# EAGLE schematic Quasar_v0.1 (EAGLE 8.7.1)
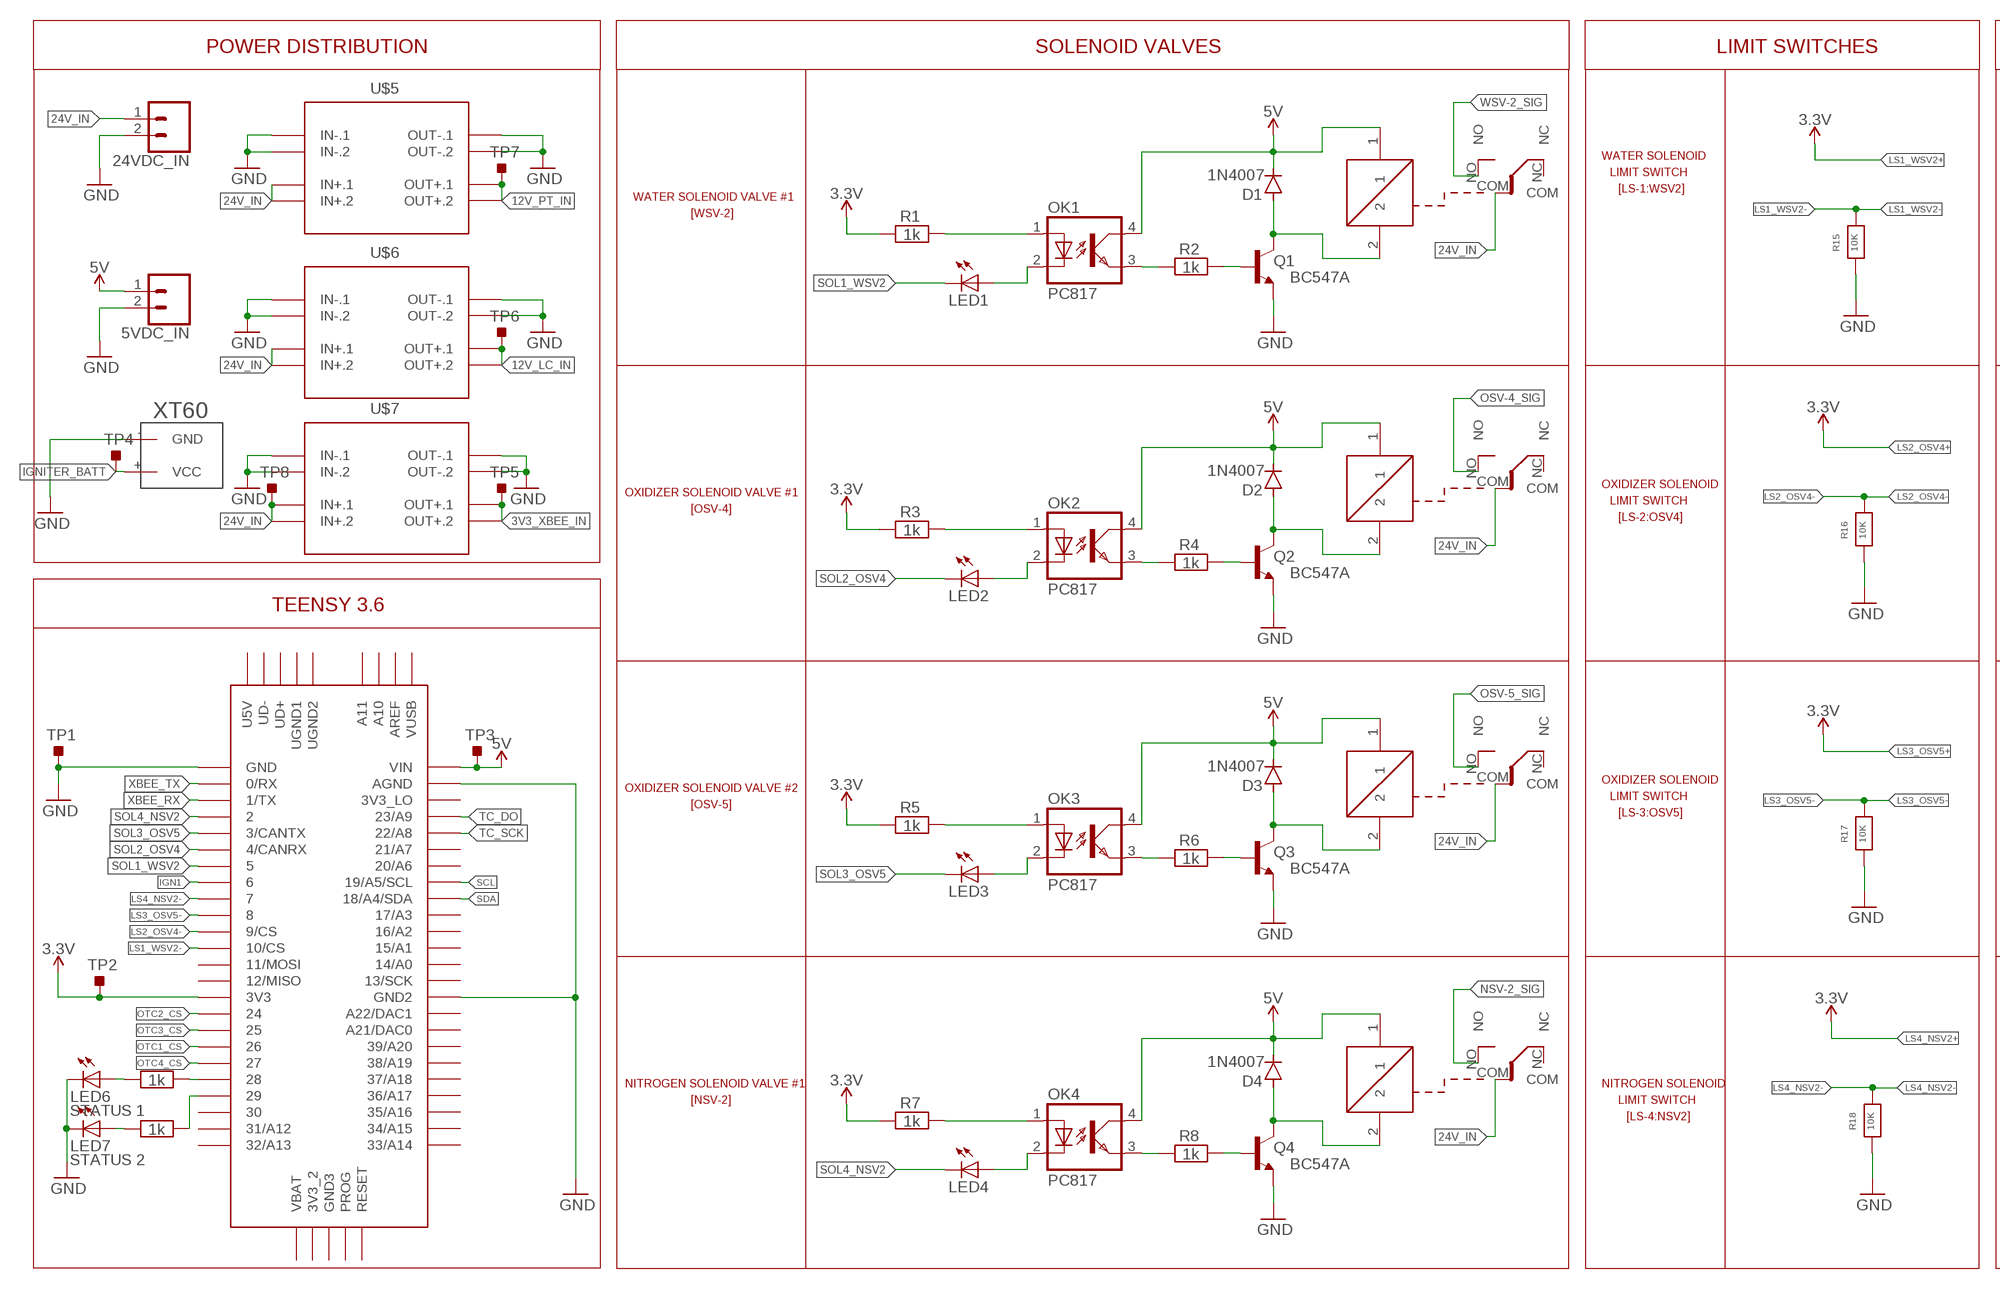
[diagram p0: schematic, sheet 1, part 1 of 2]
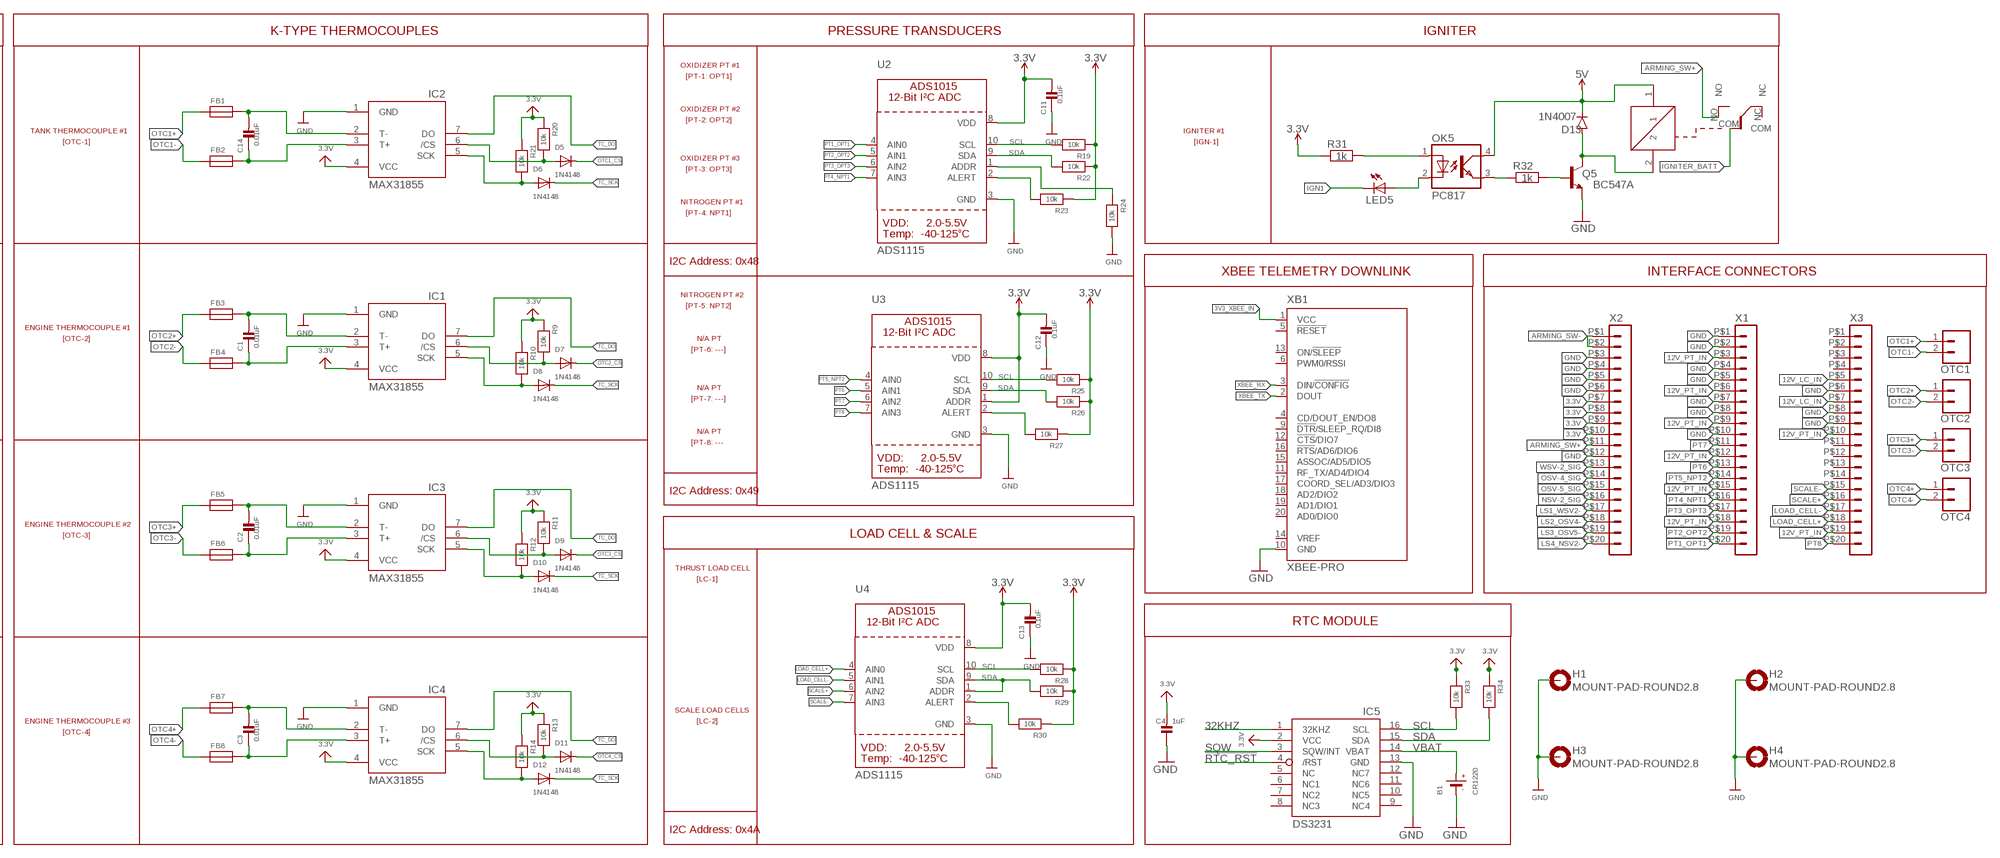
[diagram p1: schematic, sheet 1, part 2 of 2]

## Parts
5VDC_IN  CONN_025MM  [SCREWTERMINAL-5MM-2]
24VDC_IN  CONN_025MM  [SCREWTERMINAL-5MM-2]
B1  CR1220  BATTERYCR1220_SMT  [CR1220]
C1  0.01uF  CAP_CERAMIC0805  [0805]
C2  0.01uF  CAP_CERAMIC0805  [0805]
C3  0.01uF  CAP_CERAMIC0805  [0805]
C4  1uF  CAP_CERAMIC0805  [0805]
C11  0.1uF  CAP_CERAMIC0805  [0805]
C12  0.1uF  CAP_CERAMIC0805  [0805]
C13  0.1uF  CAP_CERAMIC0805  [0805]
C14  0.01uF  CAP_CERAMIC0805  [0805]
D1  1N4007  [DO-41]
D2  1N4007  [DO-41]
D3  1N4007  [DO-41]
D4  1N4007  [DO-41]
D5  1N4148  DIODESOD-123  [SOD-123]
D6  1N4148  DIODESOD-123  [SOD-123]
D7  1N4148  DIODESOD-123  [SOD-123]
D8  1N4148  DIODESOD-123  [SOD-123]
D9  1N4148  DIODESOD-123  [SOD-123]
D10  1N4148  DIODESOD-123  [SOD-123]
D11  1N4148  DIODESOD-123  [SOD-123]
D12  1N4148  DIODESOD-123  [SOD-123]
D13  1N4007  [DO-41]
FB1  FERRITE  [0603]
FB2  FERRITE  [0603]
FB3  FERRITE  [0603]
FB4  FERRITE  [0603]
FB5  FERRITE  [0603]
FB6  FERRITE  [0603]
FB7  FERRITE  [0603]
FB8  FERRITE  [0603]
H1  MOUNT-PAD-ROUND2.8  [2,8-PAD]
H2  MOUNT-PAD-ROUND2.8  [2,8-PAD]
H3  MOUNT-PAD-ROUND2.8  [2,8-PAD]
H4  MOUNT-PAD-ROUND2.8  [2,8-PAD]
IC1  MAX31855  MAX6675  [SO08]
IC2  MAX31855  MAX6675  [SO08]
IC3  MAX31855  MAX6675  [SO08]
IC4  MAX31855  MAX6675  [SO08]
IC5  DS3231/SO  [SO16W]
LED1  LEDCHIPLED_1206  [CHIPLED_1206]
LED2  LEDCHIPLED_1206  [CHIPLED_1206]
LED3  LEDCHIPLED_1206  [CHIPLED_1206]
LED4  LEDCHIPLED_1206  [CHIPLED_1206]
LED5  LEDCHIPLED_1206  [CHIPLED_1206]
LED6  STATUS 1  LED5MM  [LED5MM]
LED7  STATUS 2  LED5MM  [LED5MM]
OK1  PC817  [DIL04]
OK2  PC817  [DIL04]
OK3  PC817  [DIL04]
OK4  PC817  [DIL04]
OK5  PC817  [DIL04]
OTC1  CONN_025MM  [SCREWTERMINAL-5MM-2]
OTC2  CONN_025MM  [SCREWTERMINAL-5MM-2]
OTC3  CONN_025MM  [SCREWTERMINAL-5MM-2]
OTC4  CONN_025MM  [SCREWTERMINAL-5MM-2]
Q1  BC547A  [TO92]
Q2  BC547A  [TO92]
Q3  BC547A  [TO92]
Q4  BC547A  [TO92]
Q5  BC547A  [TO92]
R1  1k  RESISTOR0805  [0805]
R2  1k  RESISTOR0805  [0805]
R3  1k  RESISTOR0805  [0805]
R4  1k  RESISTOR0805  [0805]
R5  1k  RESISTOR0805  [0805]
R6  1k  RESISTOR0805  [0805]
R7  1k  RESISTOR0805  [0805]
R8  1k  RESISTOR0805  [0805]
R9  10k  RESISTOR0805  [0805]
R10  10k  RESISTOR0805  [0805]
R11  10k  RESISTOR0805  [0805]
R12  10k  RESISTOR0805  [0805]
R13  10k  RESISTOR0805  [0805]
R14  10k  RESISTOR0805  [0805]
R15  10K  RESISTOR0805  [0805]
R16  10K  RESISTOR0805  [0805]
R17  10K  RESISTOR0805  [0805]
R18  10K  RESISTOR0805  [0805]
R19  10k  RESISTOR0805  [0805]
R20  10k  RESISTOR0805  [0805]
R21  10k  RESISTOR0805  [0805]
R22  10k  RESISTOR0805  [0805]
R23  10k  RESISTOR0805  [0805]
R24  10k  RESISTOR0805  [0805]
R25  10k  RESISTOR0805  [0805]
R26  10k  RESISTOR0805  [0805]
R27  10k  RESISTOR0805  [0805]
R28  10k  RESISTOR0805  [0805]
R29  10k  RESISTOR0805  [0805]
R30  10k  RESISTOR0805  [0805]
R31  1k  RESISTOR0805  [0805]
R32  1k  RESISTOR0805  [0805]
R33  10k  RESISTOR0805  [0805]
R34  10k  RESISTOR0805  [0805]
R35  1k  RESISTOR0805  [0805]
R36  1k  RESISTOR0805  [0805]
TP1  TESTPOINT_TPS-SMD-10SN  [TESTPOINT_SMD-10SN]
TP2  TESTPOINT_TPS-SMD-10SN  [TESTPOINT_SMD-10SN]
TP3  TESTPOINT_TPS-SMD-10SN  [TESTPOINT_SMD-10SN]
TP4  TESTPOINT_TPS-SMD-10SN  [TESTPOINT_SMD-10SN]
TP5  TESTPOINT_TPS-SMD-10SN  [TESTPOINT_SMD-10SN]
TP6  TESTPOINT_TPS-SMD-10SN  [TESTPOINT_SMD-10SN]
TP7  TESTPOINT_TPS-SMD-10SN  [TESTPOINT_SMD-10SN]
TP8  TESTPOINT_TPS-SMD-10SN  [TESTPOINT_SMD-10SN]
U2  ADS1115  ADC_ADS1015  [MSOP10]
U3  ADS1115  ADC_ADS1015  [MSOP10]
U4  ADS1115  ADC_ADS1015  [MSOP10]
U$1  TEENSY_3.5/3.6  [TEENSY_3.5/3.6]
U$2  RW-SH  [RW-SH]
U$3  RW-SH  [RW-SH]
U$4  RW-SH  [RW-SH]
U$5  12V_PT_REG  DC-DC-STEP-DOWN-MP1584  [DC-DC-STEP-DOWN-MP1584]
U$6  12V_LC_REG  DC-DC-STEP-DOWN-MP1584  [DC-DC-STEP-DOWN-MP1584]
U$7  3V3_XBEE_REG  DC-DC-STEP-DOWN-MP1584  [DC-DC-STEP-DOWN-MP1584]
U$13  RW-SH  [RW-SH]
U$18  RW-SH  [RW-SH]
U$19  XT60  [XT60]
X1  HEADER_POS20_44914-2001  [44914-2001]
X2  HEADER_POS20_44914-2001  [44914-2001]
X3  HEADER_POS20_44914-2001  [44914-2001]
XB1  XBEE-PRO  [XBEE-PRO]

## Nets
3.3V: C4.2 C11.2 C12.2 C13.2 IC1.4(VCC) IC2.4(VCC) IC3.4(VCC) IC4.4(VCC) IC5.2(VCC) R1.2 R3.2 R5.2 R7.2 R9.1 R10.1 R11.1 R12.1 R13.1 R14.1 R19.1 R20.1 R21.1 R22.1 R23.1 R25.1 R26.1 R27.1 R28.1 R29.1 R30.1 R31.2 R33.1 R34.1 TP2.TP U2.8(VDD) U3.1(ADDR) U3.8(VDD) U4.8(VDD) U$1.3V3 X2.P$7 X2.P$8 X2.P$9 X2.P$10
3V3_XBEE_IN: TP5.TP U$7.OUT+.1 U$7.OUT+.2 XB1.1(VCC)
5V: 5VDC_IN.1 D1.C D2.C D3.C D4.C D13.C OK1.4(COL) OK2.4(COL) OK3.4(COL) OK4.4(COL) OK5.4(COL) TP3.TP U$1.VIN U$2.1 U$3.1 U$4.1 U$13.1 U$18.1
12V_LC_IN: TP6.TP U$6.OUT+.1 U$6.OUT+.2 X3.P$5 X3.P$7
12V_PT_IN: TP7.TP U$5.OUT+.1 U$5.OUT+.2 X1.P$3 X1.P$6 X1.P$9 X1.P$12 X1.P$15 X1.P$18 X3.P$10 X3.P$19
24V_IN: 24VDC_IN.1 TP8.TP U$2.COM U$3.COM U$4.COM U$5.IN+.1 U$5.IN+.2 U$6.IN+.1 U$6.IN+.2 U$7.IN+.1 U$7.IN+.2 U$13.COM
32KHZ: IC5.1(32KHZ)
!RTC_RST: IC5.4(/RST)
ARMING_SW+: U$18.NO X2.P$11
ARMING_SW-: X2.P$1 X2.P$2
GND: 5VDC_IN.2 24VDC_IN.2 B1.- C4.1 C11.1 C12.1 C13.1 H1.B2,8(MOUNT) H2.B2,8(MOUNT) H3.B2,8(MOUNT) H4.B2,8(MOUNT) IC1.1(GND) IC2.1(GND) IC3.1(GND) IC4.1(GND) IC5.13(GND) LED6.K(C) LED7.K(C) Q1.1(E) Q2.1(E) Q3.1(E) Q4.1(E) Q5.1(E) R15.2 R16.2 R17.2 R18.2 R24.2 TP1.TP U2.3(GND) U3.3(GND) U4.3(GND) U$1.AGND U$1.GND U$1.GND2 U$5.IN-.1 U$5.IN-.2 U$5.OUT-.1 U$5.OUT-.2 U$6.IN-.1 U$6.IN-.2 U$6.OUT-.1 U$6.OUT-.2 U$7.IN-.1 U$7.IN-.2 U$7.OUT-.1 U$7.OUT-.2 U$19.-(GND) X1.P$1 X1.P$2 X1.P$4 X1.P$5 X1.P$7 X1.P$8 X1.P$10 X2.P$3 X2.P$4 X2.P$5 X2.P$6 X2.P$12 X3.P$6 X3.P$8 X3.P$9 XB1.10(GND)
IGN1: LED5.C U$1.6
IGNITER_BATT: TP4.TP U$18.COM U$19.+(VCC)
LOAD_CELL+: U4.4(AIN0) X3.P$18
LOAD_CELL-: U4.5(AIN1) X3.P$17
LS1_WSV2-: R15.1 U$1.10/CS X2.P$17
LS2_OSV4-: R16.1 U$1.9/CS X2.P$18
LS3_OSV5-: R17.1 U$1.8 X2.P$19
LS4_NSV2-: R18.1 U$1.7 X2.P$20
N$1: OK1.1(A) R1.1
N$2: LED1.A OK1.2(C)
N$3: Q1.2(B) R2.1
N$4: OK1.3(EMIT) R2.2
N$5: D1.A Q1.3(C) U$13.2
N$6: OK2.1(A) R3.1
N$7: LED2.A OK2.2(C)
N$8: Q2.2(B) R4.1
N$9: OK2.3(EMIT) R4.2
N$10: D2.A Q2.3(C) U$2.2
N$11: OK3.1(A) R5.1
N$12: LED3.A OK3.2(C)
N$13: Q3.2(B) R6.1
N$14: OK3.3(EMIT) R6.2
N$15: D3.A Q3.3(C) U$3.2
N$16: OK4.1(A) R7.1
N$17: LED4.A OK4.2(C)
N$18: Q4.2(B) R8.1
N$19: OK4.3(EMIT) R8.2
N$20: D4.A Q4.3(C) U$4.2
N$21: C1.2 FB3.2 IC1.2(T-)
N$22: C1.1 FB4.2 IC1.3(T+)
N$23: D7.A IC1.6(/CS) R9.2
N$24: D8.A IC1.5(SCK) R10.2
N$25: C2.2 FB5.2 IC3.2(T-)
N$26: C2.1 FB6.2 IC3.3(T+)
N$27: C14.1 FB2.2 IC2.3(T+)
N$28: D9.A IC3.6(/CS) R11.2
N$29: D10.A IC3.5(SCK) R12.2
N$30: C3.2 FB7.2 IC4.2(T-)
N$31: C3.1 FB8.2 IC4.3(T+)
N$32: C14.2 FB1.2 IC2.2(T-)
N$33: D11.A IC4.6(/CS) R13.2
N$34: D5.A IC2.6(/CS) R20.2
N$35: D12.A IC4.5(SCK) R14.2
N$36: OK5.1(A) R31.1
N$37: LED5.A OK5.2(C)
N$38: Q5.2(B) R32.1
N$39: R23.2 U2.2(ALERT)
N$40: R27.2 U3.2(ALERT)
N$41: R24.1 U2.1(ADDR)
N$42: OK5.3(EMIT) R32.2
N$43: D13.A Q5.3(C) U$18.2
N$44: R30.2 U4.2(ALERT)
N$45: R35.1 U$1.28
N$46: R36.1 U$1.29
N$47: D6.A IC2.5(SCK) R21.2
N$48: LED6.A R35.2
N$49: LED7.A R36.2
NSV-2_SIG: U$4.NO X2.P$16
OSV-4_SIG: U$2.NO X2.P$14
OSV-5_SIG: U$3.NO X2.P$15
OTC1+: FB1.1 OTC1.1
OTC1-: FB2.1 OTC1.2
OTC1_CS: D5.C U$1.26
OTC2+: FB3.1 OTC2.1
OTC2-: FB4.1 OTC2.2
OTC2_CS: D7.C U$1.24
OTC3+: FB5.1 OTC3.1
OTC3-: FB6.1 OTC3.2
OTC3_CS: D9.C U$1.25
OTC4+: FB7.1 OTC4.1
OTC4-: FB8.1 OTC4.2
OTC4_CS: D11.C U$1.27
PT1_OPT1: U2.4(AIN0) X1.P$20
PT2_OPT2: U2.5(AIN1) X1.P$19
PT3_OPT3: U2.6(AIN2) X1.P$17
PT4_NPT1: U2.7(AIN3) X1.P$16
PT5_NPT2: U3.4(AIN0) X1.P$14
PT6: U3.5(AIN1) X1.P$13
PT7: U3.6(AIN2) X1.P$11
PT8: U3.7(AIN3) X3.P$20
SCALE+: U4.6(AIN2) X3.P$16
SCALE-: U4.7(AIN3) X3.P$15
SCL: IC5.16(SCL) R19.2 R25.2 R28.2 R33.2 U2.10(SCL) U3.10(SCL) U4.10(SCL) U$1.19/A5/SCL
SDA: IC5.15(SDA) R22.2 R26.2 R29.2 R34.2 U2.9(SDA) U3.9(SDA) U4.1(ADDR) U4.9(SDA) U$1.18/A4/SDA
SOL1_WSV2: LED1.C U$1.5
SOL2_OSV4: LED2.C U$1.4/CANRX
SOL3_OSV5: LED3.C U$1.3/CANTX
SOL4_NSV2: LED4.C U$1.2
SQW: IC5.3(SQW/INT)
TC_DO: IC1.7(DO) IC2.7(DO) IC3.7(DO) IC4.7(DO) U$1.23/A9
TC_SCK: D6.C D8.C D10.C D12.C U$1.22/A8
VBAT: B1.+$1(+) IC5.14(VBAT)
WSV-2_SIG: U$13.NO X2.P$13
XBEE_RX: U$1.1/TX XB1.3(DIN/!CONFIG)
XBEE_TX: U$1.0/RX XB1.2(DOUT)
Unconnected: IC5.5(NC) IC5.6(NC1) IC5.7(NC2) IC5.8(NC3) IC5.9(NC4) IC5.10(NC5) IC5.11(NC6) IC5.12(NC7) U$1.3V3_2 U$1.3V3_LO U$1.11/MOSI U$1.12/MISO U$1.13/SCK U$1.14/A0 U$1.15/A1 U$1.16/A2 U$1.17/A3 U$1.20/A6 U$1.21/A7 U$1.21/DAC0(A21/DAC0) U$1.30 U$1.31/A12 U$1.32/A13 U$1.33/A14 U$1.34/A15 U$1.35/A16 U$1.36/A17 U$1.37/A18 U$1.38/A19 U$1.39/A20 U$1.A10 U$1.A11 U$1.A22/DAC1 U$1.AREF U$1.GND3 U$1.PROG U$1.RESET U$1.U5V U$1.UD+ U$1.UD- U$1.UGND1 U$1.UGND2 U$1.VBAT U$1.VUSB U$2.NC U$3.NC U$4.NC U$13.NC U$18.NC X3.P$1 X3.P$2 X3.P$3 X3.P$4 X3.P$11 X3.P$12 X3.P$13 X3.P$14 XB1.4(CD/DOUT_EN/DO8) XB1.5(!RESET) XB1.6(PWM0/RSSI) XB1.9(!DTR!/SLEEP_RQ/DI8) XB1.11(RF_TX/AD4/DIO4) XB1.12(!CTS!/DIO7) XB1.13(ON/!SLEEP) XB1.14(VREF) XB1.15(ASSOC/AD5/DIO5) XB1.16(!RTS!/AD6/DIO6) XB1.17(COORD_SEL/AD3/DIO3) XB1.18(AD2/DIO2) XB1.19(AD1/DIO1) XB1.20(AD0/DIO0)

## Notes on the sheet
- POWER DISTRIBUTION | SOLENOID VALVES | LIMIT SWITCHES | K-TYPE THERMOCOUPLES | PRESSURE TRANSDUCERS | IGNITER
- OXIDIZER PT #1
- [PT-1: OPT1]
- WATER SOLENOID
- OXIDIZER PT #2
- LIMIT SWITCH
- [PT-2: OPT2]
- [LS-1:WSV2]
- WATER SOLENOID VALVE #1 | TANK THERMOCOUPLE #1 | IGNITER #1
- [WSV-2] | [OTC-1] | [IGN-1]
- OXIDIZER PT #3
- [PT-3: OPT3]
- NITROGEN PT #1
- [PT-4: NPT1]
- I2C Address: 0x48
- XBEE TELEMETRY DOWNLINK | INTERFACE CONNECTORS
- NITROGEN PT #2
- [PT-5: NPT2]
- OXIDIZER SOLENOID
- OXIDIZER SOLENOID VALVE #1 | ENGINE THERMOCOUPLE #1
- LIMIT SWITCH
- [OSV-4] | [OTC-2] | N/A PT
- [LS-2:OSV4]
- [PT-6: ---]
- N/A PT
- [PT-7: ---]
- TEENSY 3.6
- N/A PT
- [PT-8: ---
- I2C Address: 0x49
- OXIDIZER SOLENOID
- OXIDIZER SOLENOID VALVE #2 | ENGINE THERMOCOUPLE #2
- LIMIT SWITCH
- [OSV-5] | [OTC-3] | LOAD CELL & SCALE
- [LS-3:OSV5]
- THRUST LOAD CELL
- [LC-1]
- RTC MODULE
- SCALE LOAD CELLS
- NITROGEN SOLENOID VALVE #1 | NITROGEN SOLENOID | ENGINE THERMOCOUPLE #3 | [LC-2]
- [NSV-2] | LIMIT SWITCH | [OTC-4]
- [LS-4:NSV2]
- I2C Address: 0x4A

## Library data of the parts
5VDC_IN 24VDC_IN OTC1-OTC4 = SparkFun-Connectors:CONN_02: Multi connection point. Often used as Generic Header-pin footprint for 0.1 inch spaced/style header connections On any of the 0.1 inch spaced packages, you can populate with these: Break Away Headers - Straight <https://www.sparkfun.com/products/116> (PRT-00116) Break Away Male Headers - Right Angle <https://www.sparkfun.com/products/553> (PRT-00553) Female Headers <https://www.sparkfun.com/products/115> (PRT-00115) Break Away Headers - Machine Pin <https://www.sparkfun.com/products/117> (PRT-00117) Break Away Female Headers - Swiss Machine Pin <https://www.sparkfun.com/products/743> (PRT-00743) For SCREWTERMINALS and SPRING TERMINALS visit here: Screw Terimnals on SparkFun.com <https://www.sparkfun.com/search/results?term=Screw+Terminals> (5mm/3.5mm/2.54mm spacing) This device is also useful as a general connection point to wire up your design to another part of your project. Our various solder wires solder well into these plated through hole pads. Hook-Up Wire - Assortment (Stranded, 22 AWG) <https://www.sparkfun.com/products/11375> (PRT-11375) Hook-Up Wire - Assortment (Solid Core, 22 AWG) <https://www.sparkfun.com/products/11367> (PRT-11367) View the entire wire category on our website here <https://www.sparkfun.com/categories/141> Special notes: Molex polarized connector foot print use with: PRT-08233 with associated crimp pins and housings. 2.54_SCREWTERM for use with PRT-10571. 3.5mm Screw Terminal footprints for PRT-08084 5mm Screw Terminal footprints for use with PRT-08432; SF_SKU: PRT-08432
B1 = microbuilder:BATTERY: CR1220 SMT - Digikey: 3001K-ND CD2032 BAT-HLD-001 - Digikey: BAT-HLD-001-ND
C1-C4 C11-C14 = microbuilder:CAP_CERAMIC: Ceramic Capacitors 0402 - 0402 Surface Mount Capacitors 16pF 50V 5% [Digikey: 445-4899-2-ND] 18pF 50V 5% [Digikey: 490-1281-2-ND] 22pF 50V 5% [Digikey: 490-1283-2-ND] 68pF 50V 5% [Digikey: 490-1289-2-ND] 0.1uF 10V 10% [Digikey: 490-1318-2-ND] 1.0uF 6.3V 10% [Digikey: 490-1320-2-ND] 0603 - 0603 Surface Mount Capacitors 16 pF 50V 5% [Digikey: 445-5051-2-ND] 22 pF 50V [Digikey: PCC220ACVTR-ND] 33 pF 50V 5% [Digikey: 490-1415-1-ND] 56pF 50V 5% [Digikey: 490-1421-1-ND] 220pF 50V 5% [Digikey: 445-1285-1-ND] 680 pF 50V 2200 pF 50V 5% C0G [Digikey: 445-1297-1-ND] 5600 pF 100V 5% X7R [Digikey: 478-3711-1-ND] 0.1 µF 25V 10% [Digikey: PCC2277TR-ND] 0.22 µF 16V 10% X7R [Digikey: 445-1318-1-ND] 1.0 µF 25V 10% [Digikey: 445-5146-2-ND] 0603 - RF Specific 3pF 250V +/-0.1pF RF [Digikey: 712-1347-1-ND] 18 pF 250V 5% [Digikey: 478-3505-1-ND or 712-1322-1-ND] 56 pF 250V 5% C0G RF [Digikey: 490-4867-1-ND] 68 pF 250V RF [Digikey: 490-4868-1-ND] 0805 - 0805 Surface Mount Capacitors 220 pF 250V 2% RF Ceramic Capacitor [Digikey: 712-1398-1-ND] 1000 pF 50V 2% NP0 Ceramic Capacitor [Digikey: 478-3760-1-ND] 0.1 µF 25V 10% Ceramic Capacitor [Digikey: PCC1828TR-ND] 1.0 µF 16V 10% Ceramic Capacitor[Digikey: 490-1691-2-ND] 10.0 µF 10V 10% Ceramic Capacitor[Digikey: 709-1228-1-ND] 10.0 uF 16V 10% Ceramic Capacitor [Digikey: 478-5165-2-ND] 47 uF 6.3V 20% Ceramic Capacitor [Digikey: 587-1779-1-ND or 399-5506-1-ND] 1206 - 1206 Surface Mount Capacitors 47uF 10V 20% Ceramic Capacitor [Digikey: 490-5528-1-ND or 399-5508-1-ND or 445-6010-1-ND]
D1-D4 D13 = Diodes:1N4007: DIODE GEN PURP 1KV 1A DO41 Manufacturer's datasheet <https://www.mccsemi.com/pdf/Products/1N4001-1N4007(DO-41).pdf>; CREATED_BY: PCBLayout.com; DIGIKEY_PART_NUMBER: 1N4007MSCT-ND; MANUFACTURER: Micro Commercial Co; MPN: 1N4007; PACKAGE: DO-41
D5-D12 = microbuilder:DIODE: Diode SMADIODE - SMA Surface Mount Package 20V 1A Schottky Diode Digikey (500mV @ 1A, 500uA Vr @ 20V): 641-1014-6-ND 10V 2A Schottky Diode Digikey (350mV @ 2A, 700uA Vr @ 10V): MBRA210LT3 SOD-123 30V 200mA (800mV Vf, 2uA Vr @ 25V) Schottky Diode (very fast switching for boost, etc.) - Digikey: BAT54T1GOSTR-ND 30V 500mA (430mV Vf, 130uA Vr @ 30V) Schottky Diode - Digikey: B0530W-FDICT-ND MBR120 1A 20V (0.34Vf) Schottky Diode - Digikey: MBR120VLSFT1GOSCT-ND SOD-323 10V 570mA (380mV Vf, 3ns) Schottky Diode - Digikey: ZLLS410CT-ND 1N4148WS - 75V 150mA (1V Vf @ 10mA, 4ns) Simple Diode - Digikey: 1N4148WSFSCT-ND, Mouser: 512-1N4148WS SOD-523 BAT54 30V 200mA Schottky (0.8 Vf @ 100mA, 5ns) - Digikey: BAT54XV2CT-ND 30V 30mA Schottky Diode (RB751S-40TE61) - Digikey: RB751S-40TE61CT-ND SOT23-R/W - SOT23 Package (R = Solder Paste/Reflow Ovens, W = Hand-Soldering) BAT54Film 40V 300mA - Digikey: 497-7162-1-ND DO-1N4148 Through Hole Small Current Diode (any model)
FB1-FB8 = microbuilder:FERRITE: Ferrite Bead 0603 MMZ1608B121C - 120 Ohm, 600mA Ferrite Chip - Digikey: 445-2164-1-ND BK1608HW121-T - 120 Ohm, 600mA Ferrite Chip - Digikey: 587-1876-2-ND
H1-H4 = holes:MOUNT-PAD-ROUND: MOUNTING PAD, round
IC1-IC4 = adafruit:MAX6675
IC5 = adafruit:DS3231
LED1-LED7 = adafruit:LED: LED OSRAM: - CHIPLED LG R971, LG N971, LY N971, LG Q971, LY Q971, LO R971, LY R971 LH N974, LH R974 LS Q976, LO Q976, LY Q976 LO Q996 - Hyper CHIPLED LW Q18S LB Q993, LB Q99A, LB R99A - SideLED LS A670, LO A670, LY A670, LG A670, LP A670 LB A673, LV A673, LT A673, LW A673 LH A674 LY A675 LS A676, LA A676, LO A676, LY A676, LW A676 LS A679, LY A679, LG A679 - Hyper Micro SIDELED® LS Y876, LA Y876, LO Y876, LY Y876 LT Y87S - SmartLED LW L88C, LW L88S LB L89C, LB L89S, LG L890 LS L89K, LO L89K, LY L89K LS L896, LA L896, LO L896, LY L896 - TOPLED LS T670, LO T670, LY T670, LG T670, LP T670 LSG T670, LSP T670, LSY T670, LOP T670, LYG T670 LG T671, LOG T671, LSG T671 LB T673, LV T673, LT T673, LW T673 LH T674 LS T676, LA T676, LO T676, LY T676, LB T676, LH T676, LSB T676, LW T676 LB T67C, LV T67C, LT T67C, LS T67K, LO T67K, LY T67K, LW E67C LS E67B, LA E67B, LO E67B, LY E67B, LB E67C, LV E67C, LT E67C LW T67C LS T679, LY T679, LG T679 LS T770, LO T770, LY T770, LG T770, LP T770 LB T773, LV T773, LT T773, LW T773 LH T774 LS E675, LA E675, LY E675, LS T675 LS T776, LA T776, LO T776, LY T776, LB T776 LHGB T686 LT T68C, LB T68C - Hyper Mini TOPLED® LB M676 - Mini TOPLED Santana® LG M470 LS M47K, LO M47K, LY M47K Source: http://www.osram.convergy.de/
OK1-OK5 = optocoupler-3-jcn:PC817: SHARP OPTO COUPLER
Q1-Q5 = transistor-npn:BC547*: NPN Transistor
R1-R36 = microbuilder:RESISTOR: Resistors 0402 - 0402 Surface Mount Package 22 Ohm 1% 1/16W [Digikey: 311-22.0LRTR-ND] 33 Ohm 5% 1/16W 1.0K 5% 1/16W 1.5K 5% 1/16W 2.0K 1% 1/16W 10.0K 1% 1/16W [Digikey: 311-10.0KLRTR-ND] 10.0K 5% 1/16W [Digikey: RMCF0402JT10K0TR-ND] 12.1K 1% 1/16W [Digikey: 311-22.0LRTR-ND] 100.0K 5% 1/16W 0603 - 0603 Surface Mount Package 0 Ohm 1/10 Watt 1% Resistor 15 Ohm 1/10 Watt 1% Resistor 33 Ohm 1/10 Watt 1% Resistor 49.9 Ohm 1/10 Watt 1% Resistor 100 Ohm 1/10 Watt 1% Resistor 150 Ohm 1/10 Watt 1% Resistor 240 Ohm 1/10 Watt 1% Resistor 390 Ohm 1/10 Watt 1% Resistor 560 Ohm 1/10 Watt 1% Resistor 680 Ohm 1/10 Watt 1% Resistor 750 Ohm 1/10 Watt 1% Resistor 1.0K Ohm 1/10 Watt 1% Resistor 1.5K Ohm 1/10 Watt 1% Resistor 2.0K Ohm 1/10 Watt 1% Resistor 2.2K Ohm 1/10 Watt 1% Resistor 3.3K Ohm 1/10 Watt 1% Resistor 4.7K Ohm 1/10 Watt 1% Resistor 10.0K Ohm 1/10 Watt 1% Resistor 12.0K Ohm 1/10 Watt 1% Resistor 12.1K Ohm 1/10 Watt 1% Resistor 20.0K Ohm 1/10 Watt 1% Resistor 33.0K Ohm 1/10 Watt 1% Resistor 100.0K Ohm 1/10 Watt 1% Resistor 0805 - 0805 Surface Mount Package 0 Ohm 1/8 Watt 1% Resistor 33 Ohm 1/8 Watt 1% Resistor 100 Ohm 1/8 Watt 1% Resistor 150 Ohm 1/8 Watt 1% Resistor 200 Ohm 1/8 Watt 1% Resistor 240 Ohm 1/8 Watt 1% Resistor 330 Ohm 1/8 Watt 1% Resistor 390 Ohm 1/8 Watt 1% Resistor 470 Ohm 1/8 Watt 1% Resistor 1.0K Ohm 1/8 Watt 1% Resistor 1.5K Ohm 1/8 Watt 1% Resistor 2.0K Ohm 1/8 Watt 1% Resistor 4.7K Ohm 1/8 Watt 1% Resistor 5.1K Ohm 1/8 Watt 1% Resistor 5.6K Ohm 1/8 Watt 1% Resistor 10.0K Ohm 1/8 Watt 1% Resistor 22.0K Ohm 1/8 Watt 1% Resistor 33.0K Ohm 1/8 Watt 1% Resistor 100K Ohm 1/8 Watt 1% Resistor 1206 - 1206 Surface Mount Package 2012 - 2010 Surface Mount Package 0.11 Ohm 1/2 Watt 1% Resistor - Digikey: RHM.11UCT-ND
TP1-TP8 = 52101-101-REV-A:TESTPOINT_TPS: TEST POINT PAD; BOM: EXCLUDE
U2-U4 = microbuilder:ADC_ADS1015: ADS1015 - 12-bit 4-Channel I2C ADC with Internal PGA VDD: 2.0-5.5V Sampling Rate: 3.3ksps Gain Settings: 2/3, 1, 2, 4, 8, 16 I2C Address: ADDR low = 1001000x, ADDR high = 1001001x Internal Comparator The ADS1015 includes an internal comparator that can be set to output a high-level on ALERT when the conversion results exceeeds a pre-defined upper level, and will deassert itself when the level falls below a pre-defined lower threshold level. It can also be set to windowed mode where the ALERT pin will be asserted if the data exceeds the upper threshold or falls below the lower threshold.
U$1 = Teensy356:TEENSY_3.5/3.6
U$2-U$4 U$13 U$18 = goodsky1:RW-SH
U$5-U$7 = diy-modules:DC-DC-STEP-DOWN-MP1584: DC/DC Step-Down Regulator based on MP1584 chip MP1584 datasheet available here: http://www.haoyuelectronics.com/Attachment/MP1584/MP1584.pdf Click here to find device on ebay.com <http://www.ebay.com/sch/mp1584+module>
U$19 = XT60:XT60: XT60
X1-X3 = con-molex-micro-fit-3_0:HEADER_POS20_?: Molex - Micro-Fit 3.0 Series connector, 3.00mm (0.118") pitch header, 20 positions.
XB1 = maxstream:XBEE: XBee (TM) /XBee-PRO(TM) OEM RF Modules Source: MaxStream, Inc. xbee_productmanual.pdf; MPN: XBP24-AWI-001; OC_FARNELL: 1337916; OC_NEWARK: 42M2667

## Net classes
1 16mil: width 0.254 mm, drill 0.254 mm, clearance 0.127 mm
3 32mil: width 0.254 mm, drill 0.254 mm, clearance 0.127 mm